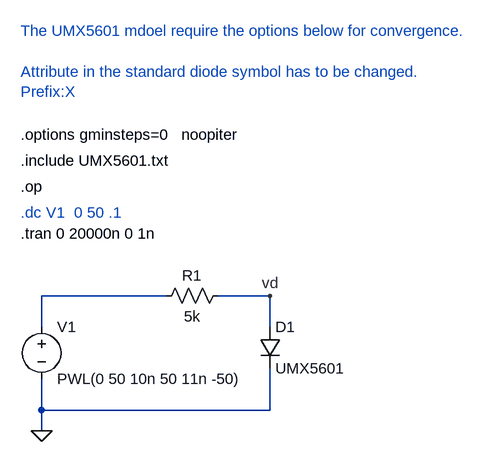
[diagram p0: schematic UMX5601_pin_diode.asc]
UMX5601_pin_diode.asc, the LTspice schematic file:
Version 4
SHEET 1 1076 1500
WIRE 144 80 -48 80
WIRE 304 80 224 80
WIRE -48 128 -48 80
WIRE 304 128 304 80
WIRE -48 256 -48 208
WIRE 304 256 304 192
WIRE 304 256 -48 256
WIRE -48 288 -48 256
FLAG -48 288 0
FLAG 304 80 vd
SYMBOL diode 288 128 R0
SYMATTR InstName D1
SYMATTR Value UMX5601
SYMATTR Prefix X
SYMBOL res 128 96 R270
WINDOW 0 32 56 VTop 0
WINDOW 3 0 56 VBottom 0
SYMATTR InstName R1
SYMATTR Value 5k
SYMBOL voltage -48 112 R0
WINDOW 123 0 0 Left 0
WINDOW 39 0 0 Left 0
SYMATTR InstName V1
SYMATTR Value PWL(0 50 10n 50 11n -50)
TEXT -80 -128 Left 0 !.include UMX5601.txt
TEXT -80 -88 Left 0 !.op
TEXT -80 -48 Left 0 ;.dc V1  0 50 .1
TEXT -80 -168 Left 0 !.options gminsteps=0   noopiter
TEXT -80 -16 Left 0 !.tran 0 20000n 0 1n
TEXT -80 -328 Left 0 ;The UMX5601 mdoel require the options below for convergence.\n \nAttribute in the standard diode symbol has to be changed.\nPrefix:X

The netlist it stands for:
* UMX5601_pin_diode.asc
XD1 vd 0 UMX5601  ; pins + -
R1 N001 vd 5k
V1 N001 0 PWL(0 50 10n 50 11n -50)
.include UMX5601.txt
.op
* .dc V1  0 50 .1
.options gminsteps=0   noopiter
.tran 0 20000n 0 1n
* The UMX5601 mdoel require the options below for convergence.
* Attribute in the standard diode symbol has to be changed.
* Prefix:X
.backanno
.end